# Altium schematic sheet Input_stage.SchDoc
size A0
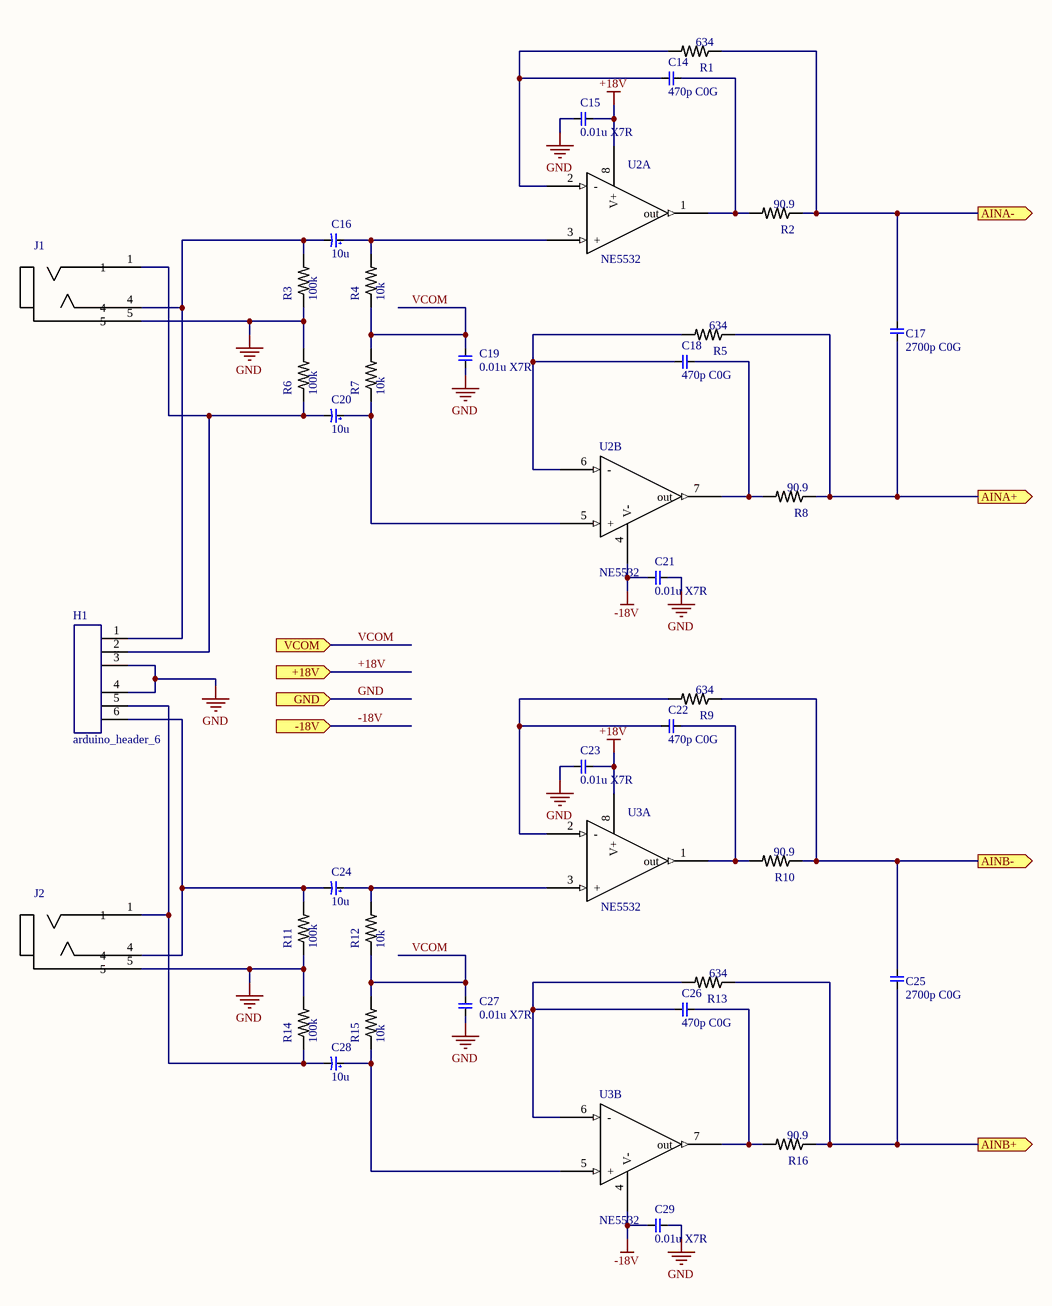
[diagram p0: Input_stage.SchDoc]

## Parts
C14  470p C0G  [0805_cap]
C15  0.01u X7R  [0805_cap]
C16  10u  [cap 4x5.4]
C17  2700p C0G  [0805_cap]
C18  470p C0G  [0805_cap]
C19  0.01u X7R  [0805_cap]
C20  10u  [cap 4x5.4]
C21  0.01u X7R  [0805_cap]
C22  470p C0G  [0805_cap]
C23  0.01u X7R  [0805_cap]
C24  10u  [cap 4x5.4]
C25  2700p C0G  [0805_cap]
C26  470p C0G  [0805_cap]
C27  0.01u X7R  [0805_cap]
C28  10u  [cap 4x5.4]
C29  0.01u X7R  [0805_cap]
H1  arduino_header_6  [header-6_male]
J1  35RASMT2BHNTRX  [SWITCHCRAFT_35RASMT2BHNTRX]  (value not drawn)
J2  35RASMT2BHNTRX  [SWITCHCRAFT_35RASMT2BHNTRX]  (value not drawn)
R1  634  [0805]
R2  90.9  [0805]
R3  100k  [0805]
R4  10k  [0805]
R5  634  [0805]
R6  100k  [0805]
R7  10k  [0805]
R8  90.9  [0805]
R9  634  [0805]
R10  90.9  [0805]
R11  100k  [0805]
R12  10k  [0805]
R13  634  [0805]
R14  100k  [0805]
R15  10k  [0805]
R16  90.9  [0805]
U2  NE5532  [SOIC-8]  (parts A,B of 2)
U3  NE5532  [SOIC-8]  (parts A,B of 2)

## Ports
+18V (in), -18V (in), AINA+ (out), AINA- (out), AINB+ (out), AINB- (out), GND (in), VCOM (in)

## Nets
+18V: C15.2 C23.2 U2.8(V+) U3.8(V+) ; port +18V
-18V: C21.2 C29.2 U2.4(V-) U3.4(V-) ; port -18V
GND: C15.1 C19.1 C21.1 C23.1 C27.1 C29.1 H1.3 H1.4 J1.5 J2.5 R3.1 R6.2 R11.1 R14.2 ; port GND
AINA+: C17.2 R5.1 R8.1 ; port AINA+
AINA-: C17.1 R1.1 R2.1 ; port AINA-
AINB+: C25.2 R13.1 R16.1 ; port AINB+
AINB-: C25.1 R9.1 R10.1 ; port AINB-
VCOM: C19.2 C27.2 R4.1 R7.2 R12.1 R15.2 ; port VCOM
NetC14_1: C14.1 R2.2 U2.1(out)
NetC14_2: C14.2 R1.2 U2.2(-)
NetC16_1: C16.1 R4.2 U2.3(+)
NetC16_2: C16.2 H1.1 J1.4 R3.2
NetC18_1: C18.1 R8.2 U2.7(out)
NetC18_2: C18.2 R5.2 U2.6(-)
NetC20_1: C20.1 R7.1 U2.5(+)
NetC20_2: C20.2 H1.2 J1.1 R6.1
NetC22_1: C22.1 R10.2 U3.1(out)
NetC22_2: C22.2 R9.2 U3.2(-)
NetC24_1: C24.1 R12.2 U3.3(+)
NetC24_2: C24.2 H1.6 J2.4 R11.2
NetC26_1: C26.1 R16.2 U3.7(out)
NetC26_2: C26.2 R13.2 U3.6(-)
NetC28_1: C28.1 R15.1 U3.5(+)
NetC28_2: C28.2 H1.5 J2.1 R14.1

## Library data of the parts
C14 C15 C17-C19 C21-C23 C25-C27 C29 = Cap
C16 C20 C24 C28 = Cap_electrolytic
J1 J2 = 3.5mm jack stereo smd: Conn 3.5MM Stereo Jack F 3 POS Solder RA SMD 3 Terminal 1 Port T/R; MF: Switchcraft; MP: 35RASMT2BHNTRX; Package: None; Price: 0.84 USD; Availability: Good; SnapEDA_Link: https://www.snapeda.com/parts/35RASMT2BHNTRX/Switchcraft%20Inc./view-part/?ref=snap; Value: *
R1-R16 = res my: RES SMD  1/8W 0805; MF: Yageo; MP: AC0805JR-070RL; Package: 0805 Yageo; Price: 0.01 USD; Availability: Good; Value: *
U2 U3 = OPA2277